# Altium schematic sheet FULL_CB_Servo_REV_D.SchDoc
size A4; DrawnBy: Philip Rowse
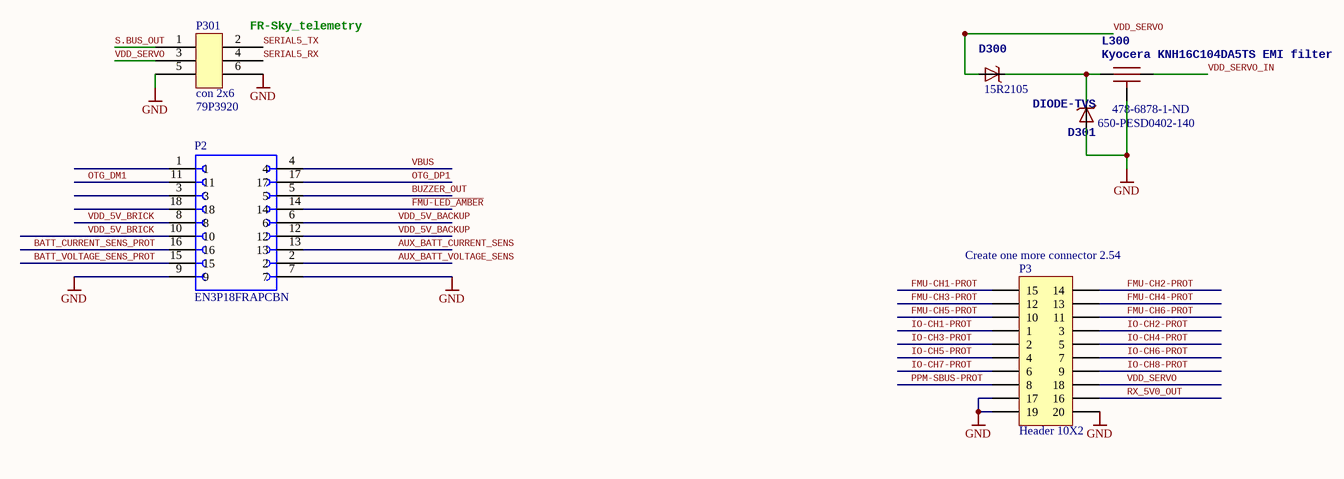
[diagram p0: FULL_CB_Servo_REV_D.SchDoc]

## Parts
D300  Supplier Part Number 1: 15R2105  [MICROSMP]  (hidden comment: MSS1P4-M3)
D301  DIODE-TVS  Supplier Part Number 1: 650-PESD0402-140  [0402-TVS]
L300  Kyocera KNH16C104DA5TS EMI filter  Supplier Part Number 1: 478-6878-1-ND  [KYOCERA-KNH16-DA]
P2  EN3P18FRAPCBN  [SWITCHCRAFT_EN3P18FRAPCBN]
P3  Header 10X2  [HDR2X10]
P301  con 2x6  Supplier Part Number 1: 79P3920  [TSW-103-07-G-D]

## Nets
GND: D301.A L300.GND P2.7 P2.9 P3.17 P3.19 P3.20 P301.5 P301.6
AUX_BATT_CURRENT_SENS: P2.13
AUX_BATT_VOLTAGE_SENS: P2.2
BATT_CURRENT_SENS_PROT: P2.16
BATT_VOLTAGE_SENS_PROT: P2.15
BUZZER_OUT: P2.5
~{FMU-LED_AMBER}: P2.14
FMU-CH1-PROT: P3.15
FMU-CH2-PROT: P3.14
FMU-CH3-PROT: P3.12
FMU-CH4-PROT: P3.13
FMU-CH5-PROT: P3.10
FMU-CH6-PROT: P3.11
IO-CH1-PROT: P3.1
IO-CH2-PROT: P3.3
IO-CH3-PROT: P3.2
IO-CH4-PROT: P3.5
IO-CH5-PROT: P3.4
IO-CH6-PROT: P3.7
IO-CH7-PROT: P3.6
IO-CH8-PROT: P3.9
OTG_DM1: P2.11
OTG_DP1: P2.17
PPM-SBUS-PROT: P3.8
RX_5V0_OUT: P3.16
S.BUS_OUT: P301.1
SERIAL5_RX: P301.4
SERIAL5_TX: P301.2
VBUS: P2.4
VDD_5V_BACKUP: P2.6 P2.12
VDD_5V_BRICK: P2.8 P2.10
VDD_SERVO: D300.ANODE(A) P3.18 P301.3
VDD_SERVO_IN: L300.P$2
NetD300_CATHODE: D300.CATHODE(C) D301.C L300.P$1

Not connected (* = marked no-connect by the designer): P2 1 3 18

## Notes on the sheet
- (near P301) FR-Sky_telemetry
- (near P3) Create one more connector 2.54
- Title
- Size:
- Date:
- A4
- Number:
- Time:
- Revision:
- Sheet
- of
- File:

## Library data of the parts
D300 = DIODE-SCHOTTKY_MSMP: Diode, Schottky, 40V, 1A, MicroSMP, SMD; Supplier 1: Newark
D301 = DIODE-TVS: Diode, TVS, 14VWM, 40VC, 0402, SMD; Supplier 1: Mouser
L300 = KNH16C104DA5TS: Capacitor, Filter, 0.1uF, 25V, 2A, 0603, SMD; Supplier 1: Digi-Key
P3 = Header 10X2: Header, 10-Pin, Dual row; LatestRevisionDate: 17-Jul-2002; LatestRevisionNote: Re-released for DXP Platform.; Publisher: Altium Limited
P301 = con 2x6: Connector, Header, 6Pos, 2.54MM, Vert, THT, Au; Supplier 1: Newark
P2 = EN3P18FRAPCBN: Package: None; Price: None; Value: *; MP: EN3P18FRAPCBN; Availability: Unavailable